# Altium schematic sheet Consumer.SchDoc
size A4
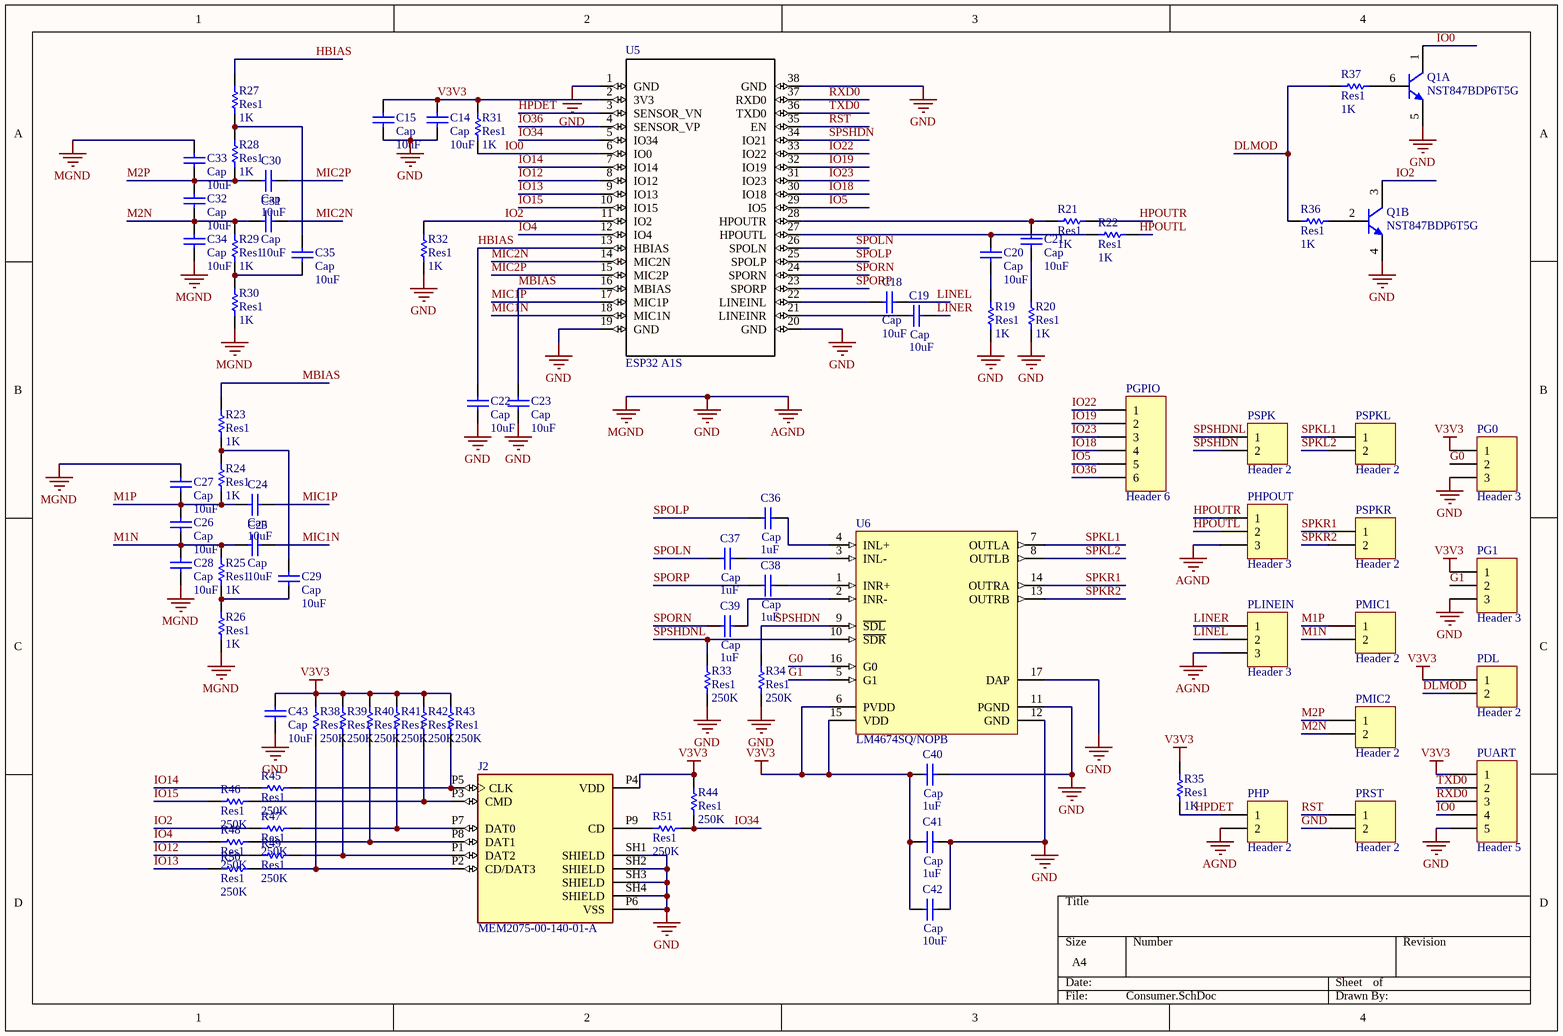
[diagram p0: Consumer.SchDoc]

## Parts
C14  Cap  value 10uF  [1812]
C15  Cap  value 10uF  [1608[0603]]
C18  Cap  value 10uF  [1608[0603]]
C19  Cap  value 10uF  [1608[0603]]
C20  Cap  value 10uF  [1608[0603]]
C21  Cap  value 10uF  [1608[0603]]
C22  Cap  value 10uF  [1608[0603]]
C23  Cap  value 10uF  [1608[0603]]
C24  Cap  value 10uF  [1608[0603]]
C25  Cap  value 10uF  [1608[0603]]
C26  Cap  value 10uF  [1608[0603]]
C27  Cap  value 10uF  [1608[0603]]
C28  Cap  value 10uF  [1608[0603]]
C29  Cap  value 10uF  [1608[0603]]
C30  Cap  value 10uF  [1608[0603]]
C31  Cap  value 10uF  [1608[0603]]
C32  Cap  value 10uF  [1608[0603]]
C33  Cap  value 10uF  [1608[0603]]
C34  Cap  value 10uF  [1608[0603]]
C35  Cap  value 10uF  [1608[0603]]
C36  Cap  value 1uF  [1608[0603]]
C37  Cap  value 1uF  [1608[0603]]
C38  Cap  value 1uF  [1608[0603]]
C39  Cap  value 1uF  [1608[0603]]
C40  Cap  value 1uF  [1608[0603]]
C41  Cap  value 1uF  [1608[0603]]
C42  Cap  value 10uF  [1608[0603]]
C43  Cap  value 10uF  [1608[0603]]
J2  MEM2075-00-140-01-A  [GCT_MEM2075-00-140-01-A]
PDL  Header 2  [HDR1X2]
PG0  Header 3  [HDR1X3]
PG1  Header 3  [HDR1X3]
PGPIO  Header 6  [HDR1X6]
PHP  Header 2  [HDR1X2]
PHPOUT  Header 3  [HDR1X3]
PLINEIN  Header 3  [HDR1X3]
PMIC1  Header 2  [HDR1X2]
PMIC2  Header 2  [HDR1X2]
PRST  Header 2  [HDR1X2]
PSPK  Header 2  [HDR1X2]
PSPKL  Header 2  [HDR1X2]
PSPKR  Header 2  [HDR1X2]
PUART  Header 5  [HDR1X5]
Q1  NST847BDP6T5G  [ONSC-SOT-963-6-527AD-01_B_V]  (parts A,B of 2)
R19  Res1  value 1K  [0603R-GENERIC]
R20  Res1  value 1K  [0603R-GENERIC]
R21  Res1  value 1K  [0603R-GENERIC]
R22  Res1  value 1K  [0603R-GENERIC]
R23  Res1  value 1K  [0603R-GENERIC]
R24  Res1  value 1K  [0603R-GENERIC]
R25  Res1  value 1K  [0603R-GENERIC]
R26  Res1  value 1K  [0603R-GENERIC]
R27  Res1  value 1K  [0603R-GENERIC]
R28  Res1  value 1K  [0603R-GENERIC]
R29  Res1  value 1K  [0603R-GENERIC]
R30  Res1  value 1K  [0603R-GENERIC]
R31  Res1  value 1K  [0603R-GENERIC]
R32  Res1  value 1K  [0603R-GENERIC]
R33  Res1  value 250K  [0603R-GENERIC]
R34  Res1  value 250K  [0603R-GENERIC]
R35  Res1  value 1K  [0603R-GENERIC]
R36  Res1  value 1K  [0603R-GENERIC]
R37  Res1  value 1K  [0603R-GENERIC]
R38  Res1  value 250K  [0603R-GENERIC]
R39  Res1  value 250K  [0603R-GENERIC]
R40  Res1  value 250K  [0603R-GENERIC]
R41  Res1  value 250K  [0603R-GENERIC]
R42  Res1  value 250K  [0603R-GENERIC]
R43  Res1  value 250K  [0603R-GENERIC]
R44  Res1  value 250K  [0603R-GENERIC]
R45  Res1  value 250K  [0603R-GENERIC]
R46  Res1  value 250K  [0603R-GENERIC]
R47  Res1  value 250K  [0603R-GENERIC]
R48  Res1  value 250K  [0603R-GENERIC]
R49  Res1  value 250K  [0603R-GENERIC]
R50  Res1  value 250K  [0603R-GENERIC]
R51  Res1  value 250K  [0603R-GENERIC]
U5  ESP32 A1S  [ESP32 A1S]
U6  LM4674SQ/NOPB  [RGH0016A_V]

## Nets
GND: C14.1 C15.1 C22.1 C23.1 C27.1 C28.2 C33.1 C34.2 C40.1 C41.1 C42.1 C43.2 J2.P6(VSS) J2.SH1(SHIELD) J2.SH2(SHIELD) J2.SH3(SHIELD) J2.SH4(SHIELD) PG0.3 PG1.3 PHP.2 PHPOUT.3 PLINEIN.3 PRST.2 PUART.5 Q1.4(E) Q1.5(E) R19.2 R20.1 R26.2 R30.2 R32.2 R33.2 R34.2 U5.1(GND) U5.19(GND) U5.20(GND) U5.38(GND) U6.11(PGND) U6.12(GND) U6.17(DAP)  [also labelled AGND, MGND]
V3V3: C14.2 C15.2 C40.2 C41.2 C42.2 C43.1 J2.P4(VDD) PDL.1 PG0.1 PG1.1 PUART.1 R31.1 R35.1 R38.1 R39.1 R40.1 R41.1 R42.1 R43.1 R44.1 U5.2(3V3) U6.6(PVDD) U6.15(VDD)
DLMOD: PDL.2 R36.2 R37.2
G0: PG0.2 U6.16(G0)
G1: PG1.2 U6.5(G1)
HBIAS: C22.2 R27.1 U5.13(HBIAS)
HPDET: PHP.1 R35.2 U5.3(SENSOR_VN)
HPOUTL: PHPOUT.2 R22.1
HPOUTR: PHPOUT.1 R21.1
IO0: PUART.4 Q1.1(C) R31.2 U5.6(IO0)
IO2: Q1.3(C) R32.1 R47.1 U5.11(IO2)
IO4: R48.1 U5.12(IO4)
IO5: PGPIO.5 U5.29(IO5)
IO12: R49.1 U5.8(IO12)
IO13: R50.1 U5.9(IO13)
IO14: R45.1 U5.7(IO14)
IO15: R46.1 U5.10(IO15)
IO18: PGPIO.4 U5.30(IO18)
IO19: PGPIO.2 U5.32(IO19)
IO22: PGPIO.1 U5.33(IO22)
IO23: PGPIO.3 U5.31(IO23)
IO34: R44.2 R51.2 U5.5(IO34)
IO36: PGPIO.6 U5.4(SENSOR_VP)
LINEL: C18.1 PLINEIN.2
LINER: C19.1 PLINEIN.1
M1N: C25.2 C26.2 C28.1 PMIC1.2 R25.1
M1P: C24.2 C26.1 C27.2 PMIC1.1 R24.2
M2N: C31.2 C32.2 C34.1 PMIC2.2 R29.1
M2P: C30.2 C32.1 C33.2 PMIC2.1 R28.2
MBIAS: C23.2 R23.1 U5.16(MBIAS)
MIC1N: C25.1 U5.18(MIC1N)
MIC1P: C24.1 U5.17(MIC1P)
MIC2N: C31.1 U5.14(MIC2N)
MIC2P: C30.1 U5.15(MIC2P)
RST: PRST.1 U5.35(EN)
RXD0: PUART.3 U5.37(RXD0)
SPKL1: PSPKL.1 U6.7(OUTLA)
SPKL2: PSPKL.2 U6.8(OUTLB)
SPKR1: PSPKR.1 U6.14(OUTRA)
SPKR2: PSPKR.2 U6.13(OUTRB)
SPOLN: C37.2 U5.26(SPOLN)
SPOLP: C36.2 U5.25(SPOLP)
SPORN: C39.2 U5.24(SPORN)
SPORP: C38.2 U5.23(SPORP)
SPSHDN: PSPK.2 R34.1 U5.34(IO21) U6.9(~{SDL})
SPSHDNL: PSPK.1 R33.1 U6.10(~{SDR})
TXD0: PUART.2 U5.36(TXD0)
NetC18_2: C18.2 U5.22(LINEINL)
NetC19_2: C19.2 U5.21(LINEINR)
NetC20_1: C20.1 R19.1
NetC20_2: C20.2 R22.2 U5.27(HPOUTL)
NetC21_1: C21.1 R20.2
NetC21_2: C21.2 R21.2 U5.28(HPOUTR)
NetC29_1: C29.1 R23.2 R24.1
NetC29_2: C29.2 R25.2 R26.1
NetC35_1: C35.1 R27.2 R28.1
NetC35_2: C35.2 R29.2 R30.1
NetC36_1: C36.1 U6.4(INL+)
NetC37_1: C37.1 U6.3(INL-)
NetC38_1: C38.1 U6.1(INR+)
NetC39_1: C39.1 U6.2(INR-)
NetJ2_P1: J2.P1(DAT2) R39.2 R49.2
NetJ2_P2: J2.P2(CD/DAT3) R38.2 R50.2
NetJ2_P3: J2.P3(CMD) R42.2 R46.2
NetJ2_P5: J2.P5(CLK) R43.2 R45.2
NetJ2_P7: J2.P7(DAT0) R41.2 R47.2
NetJ2_P8: J2.P8(DAT1) R40.2 R48.2
NetJ2_P9: J2.P9(CD) R51.1
NetQ1_2: Q1.2(B) R36.1
NetQ1_6: Q1.6(B) R37.1

## Library data of the parts
C14 C15 C18-C43 = Cap: Capacitor; Published: 8-Jun-2000; LatestRevisionDate: 17-Jul-2002; LatestRevisionNote: Re-released for DXP Platform.; PackageReference: RAD-0.3; Publisher: Altium Limited; PackageDescription: Radial Cap, Thru-Hole; 2 Leads; 0.3 in Pin Spacing
J2 = MEM2075-00-140-01-A: 9 _8 + 1_ Position Card Connector microSDâ„¢ Surface Mount, Right Angle Gold; MF: Global Connector Technology; Availability: Unavailable; Price: None; SnapEDA_Link: https://www.snapeda.com/parts/MEM2075-00-140-01-A/Global%20Connector%20Technology/view-part/2680480/?ref=snap; Value: *; Package: Package Analog Devices; MP: MEM2075-00-140-01-A
PDL PHP PMIC1 PMIC2 PRST PSPK PSPKL PSPKR = Header 2: Header, 2-Pin; LatestRevisionDate: 17-Jul-2002; LatestRevisionNote: Re-released for DXP Platform.; Publisher: Altium Limited
PG0 PG1 PHPOUT PLINEIN = Header 3: Header, 3-Pin; LatestRevisionDate: 17-Jul-2002; LatestRevisionNote: Re-released for DXP Platform.; Publisher: Altium Limited
PGPIO = Header 6: Header, 6-Pin; LatestRevisionDate: 17-Jul-2002; LatestRevisionNote: Re-released for DXP Platform.; Publisher: Altium Limited
PUART = Header 5: Header, 5-Pin; LatestRevisionDate: 17-Jul-2002; LatestRevisionNote: Re-released for DXP Platform.; Publisher: Altium Limited
Q1 = CMP-1048-01004-1: Dual General Purpose Transistors, 6-Pin SOT-963, Pb-Free, Tape and Reel; Manufacturer: On Semiconductor; fT Min (MHz): 100; IC Continuous (A): 0.1; Polarity: Dual NPN; ComponentLink1Description: Manufacturer URL; ComponentLink2Description: Datasheet; ComponentLink3URL: http://www.onsemi.com/pub_link/Collateral/NST847BDP6-D.PDF; ComponentLink3Description: Package Specification; PartNumber: NST847BDP6T5G; RoHS: TRUE; PackageDescription: 6-Pin SOT23, Body 1 x 0.8 mm, Pitch 0.35 mm; ComponentLink2URL: http://www.onsemi.com/pub_link/Collateral/NST847BDP6-D.PDF; Packing: Tape and Reel; ComponentLink1URL: http://www.onsemi.com/; Mounting Technology: Surface Mount; PackageVersion: Rev. B, 04/2008; DatasheetVersion: Rev. 0; PackageReference: SOT-963-6-527AD-01_B
R19-R51 = Res1: Resistor; Published: 8-Jun-2000; LatestRevisionDate: 17-Jul-2002; LatestRevisionNote: Re-released for DXP Platform.; PackageReference: AXIAL-0.3; Publisher: Altium Limited; PackageDescription: Axial Device, Thru-Hole; 2 Leads; 0.3 in Pin Spacing
U5 = ESP32 A1S: MP: SAMTEC-FTS-110-01-X-S; Package: None; Price: None; Value: *; Availability: Unavailable
U6 = CMP-0057-00288-4: Filterless 2.5 Stereo Class D Audio Power Amplifier, 16-pin LLP, Pb-Free; Manufacturer: Texas Instruments; PowerWise: Y; CompType: Audio IC; PackageTopMarking: NS*UZXYTT*L4674SQ; RoHS: Y; PinCount: 16; PartNumber: LM4674SQ/NOPB; ComponentLink1URL: http://www.ti.com/general/docs/lit/getliterature.tsp?genericPartNumber=LM4674&fileType=pdf; PackageDescription: LLP, Plastic, Quad, 4 x 4 x 0.8mm Body, 16 Lead, 0.5mm Pitch, No Pullback; High-Reliability: Y; ComponentLink1Description: Datasheet URL; PackageReference: RGH0016A